# Altium project BTM_MAIN_UNIT.PrjPcb (part 2 of 3)

## Sheet SIM_INTERFACE.SchDoc
size A; SheetNumber: 13; SheetTotal: 28
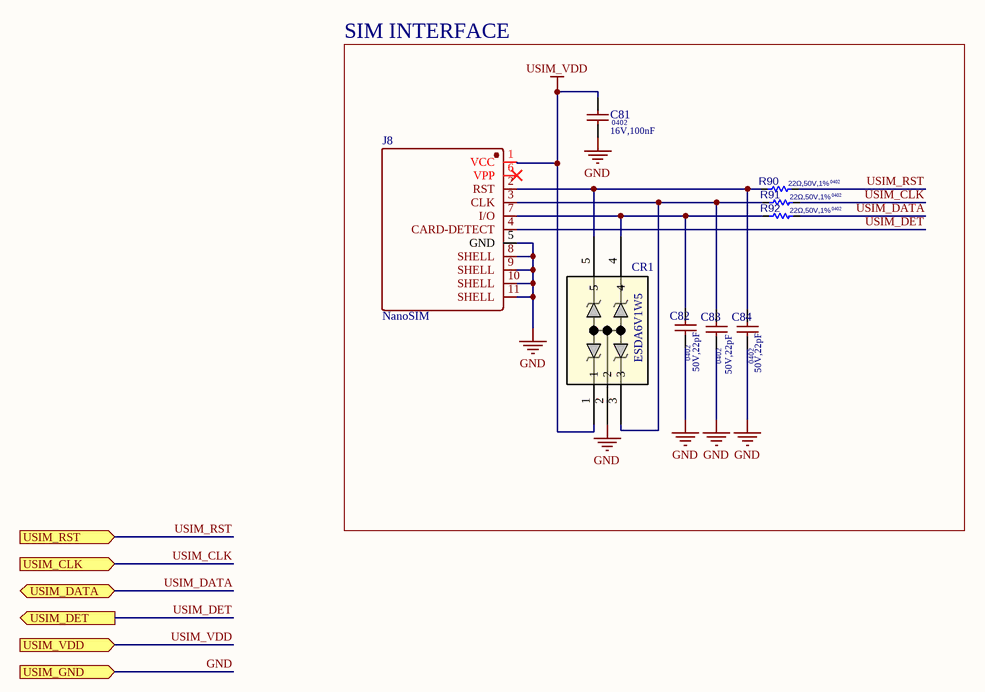
[diagram p11: SIM_INTERFACE.SchDoc]

### Parts
C81  value 16V,100nF  Package: 0402  [C0402]  (hidden comment: 100nf)
C82  value 50V,22pF  Package: 0402  [C0402]  (hidden comment: 22pF)
C83  value 50V,22pF  Package: 0402  [C0402]  (hidden comment: 22pF)
C84  value 50V,22pF  Package: 0402  [C0402]  (hidden comment: 22pF)
CR1  ESDA6V1W5  [SOT323-5L_STM]
J8  NanoSIM  [XKNANO-113]
R90  value 22Ω,50V,1%  Package: 0402  [R0402]  (hidden comment: 100KΩ)
R91  value 22Ω,50V,1%  Package: 0402  [R0402]  (hidden comment: 100KΩ)
R92  value 22Ω,50V,1%  Package: 0402  [R0402]  (hidden comment: 100KΩ)

### Blocks framed on the sheet
SIM INTERFACE: C81-C84 CR1 J8 R90-R92

### Ports
USIM_CLK (in), USIM_DATA (bidir), USIM_DET (out), USIM_GND (in), USIM_RST (in), USIM_VDD (in)

### Nets
GND: C81.1 C82.1 C83.1 C84.1 CR1.2 J8.5(GND) J8.8(SHELL) J8.9(SHELL) J8.10(SHELL) J8.11(SHELL) ; port USIM_GND
USIM_VDD: C81.2 CR1.1 J8.1(VCC) ; port USIM_VDD
USIM_CLK: R91.2 ; port USIM_CLK
USIM_DATA: R92.2 ; port USIM_DATA
USIM_DET: J8.4(CARD-DETECT) ; port USIM_DET
USIM_RST: R90.2 ; port USIM_RST
NetC82_2: C82.2 CR1.4 J8.7(I/O) R92.1
NetC83_2: C83.2 CR1.3 J8.3(CLK) R91.1
NetC84_2: C84.2 CR1.5 J8.2(RST) R90.1

Not connected (* = marked no-connect by the designer): J8 6(VPP)*

### Library data of the parts
C81 = CL05B104KO5NNNC: 16V 100nF X7R ±10% 0402 Multilayer Ceramic Capacitors MLCC - SMD/SMT ROHS; Manufacturer: KEMET; MPN: CC0603KRX7R9BB104; Datasheet: http://componentsearchengine.com/Datasheets/3/CC0603KRX7R9BB104.pdf; LCSC: C1525
C82-C84 = 0402CG220J500NT: 50V 22pF C0G ±5% 0402 Multilayer Ceramic Capacitors MLCC - SMD/SMT ROHS; Manufacturer: KEMET; MPN: CC0603KRX7R9BB104; Datasheet: http://componentsearchengine.com/Datasheets/3/CC0603KRX7R9BB104.pdf; LCSC: C1555
CR1 = ESDA6V1W5: Clamp Ipp Tvs Diode Surface Mount SOT-323-5; Manufacturer: STMicroelectronics; RefDes: RefDes; Type: Type; MPN: ESDA6V1W5; LCSC: C48677; Package: SOT-353-5L
J8 = XKNANO-113: Copper Alloy Self bomb Gold plating 1.25mm Deck -40℃~+85℃ 260℃ NanoSIM SMD SIM Card Connectors ROHS; Datasheet Link: https://datasheet.lcsc.com/lcsc/2110151630_XKB-Connection-XKNANO-113_C381071.pdf; LCSC: C381071; MPN: XKNANO-113
R90-R92 = RC0402FR-0722RL: 62.5mW Thick Film Resistors 50V ±100ppm/℃ ±1% 22Ω 0402 Chip Resistor - Surface Mount ROHS; Manufacturer: YAGEO; Max Operating Temp: +155; Type: *; Datasheet: https://datasheet.lcsc.com/lcsc/2304140030_YAGEO-RC0402FR-0722RL_C114765.pdf; MPN: RC0402FR-0722RL; Min Operating Temp: -55; LCSC: C114765

## Sheet BUZZER.SchDoc
size A; SheetNumber: 13; SheetTotal: 31
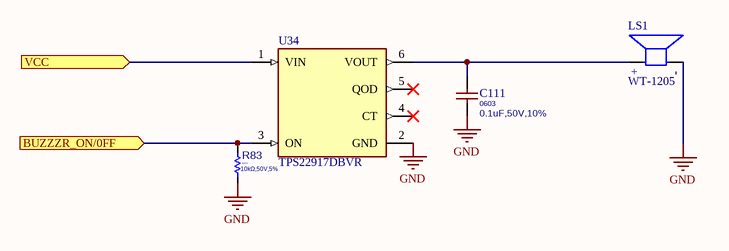
[diagram p12: BUZZER.SchDoc]

### Parts
C111  Package: 0603  [C0603]  (hidden comment: 0.1uF,50V,10%)
LS1  WT-1205  [XDCR_AT-1224-TWT-5V-2-R]
R83  value 10kΩ,50V,5%  Package: 0402  [R0402]  (hidden comment: 10kΩ)
U34  TPS22917DBVR  [SOT95P280X145-6N]

### Ports
BUZZZR_ON/0FF (in), VCC (in)

### Nets
+4.2V: U34.1(VIN) ; port VCC
GND: C111.1 LS1.N R83.1 U34.2(GND)
BUZZER: R83.2 U34.3(ON) ; port BUZZZR_ON/0FF
NetC111_2: C111.2 LS1.P U34.6(VOUT)

Not connected (* = marked no-connect by the designer): U34 4(CT)* 5(QOD)*

### Notes on the sheet
- (in symbol WT-1205) +; -

### Library data of the parts
C111 = GCM188R71H104KA57J: CAP CER 0.1UF 50V X7R 0603; Manufacturer: Murata Electronics; Type: SM; Min Operating Temp: -55°C; Max Operating Temp: 125°C; MPN: GCM188R71H104KA57J; Datasheet: https://datasheet.lcsc.com/lcsc/2404081050_Murata-Electronics-GCM188R71H104KA57J_C3011652.pdf; LCSC: C3011652; Value: 0.1uF,50V,10%
LS1 = WT-1205: Buzzers Transducer, Externally Driven Magnetic 5 V 50mA 2.4kHz 87dB @ 5V, 10cm Through Hole PC Pins; MP: AT-1224-TWT-5V-2-R; Package: None; Price: None; Value: *; Availability: Unavailable
R83 = RC0402JR-0710KL: as R60 on sheet BQ24259RGER; MPN: RC0402JR-0710KL; Max Operating Temp: +155; Min Operating Temp: -55; Datasheet: https://datasheet.lcsc.com/lcsc/1810241334_YAGEO-RC0402JR-0710KL_C60489.pdf; LCSC: C60489
U34 = TPS22917DBVR: 5.5-V, 2-A, 80-mÎ© , 10-nA leakage load switch adj. rise time and adj output discharge; MF: Texas Instruments; SnapEDA_Link: https://www.snapeda.com/parts/TPS22917DBVR/Texas+Instruments/view-part/?ref=snap; Package: SOT-23-6 Texas Instruments; Value: *; MP: TPS22917DBVR; Check_prices: https://www.snapeda.com/parts/TPS22917DBVR/Texas+Instruments/view-part/?ref=eda

## Sheet ESP8266 MODULE.SchDoc
size A; SheetNumber: 15; SheetTotal: 30
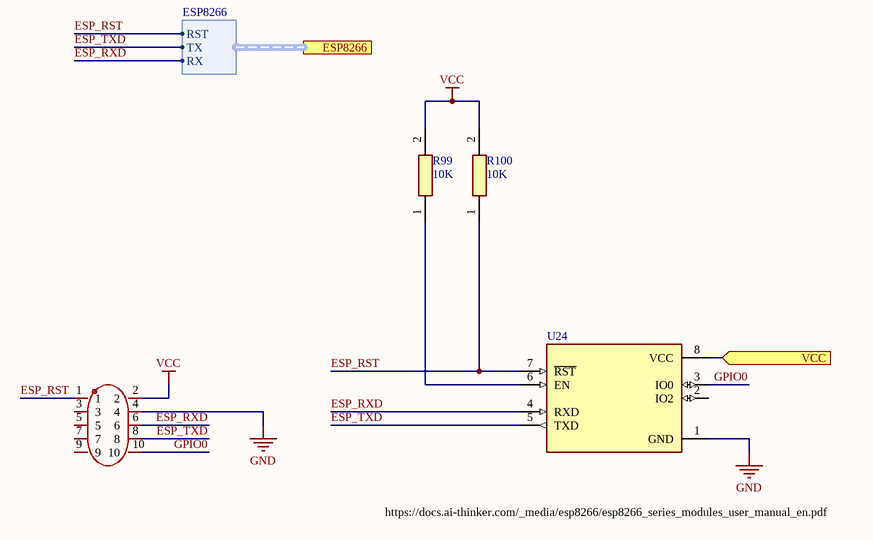
[diagram p13: ESP8266 MODULE.SchDoc]

### Parts
R99  10K  [r-0603]
R100  10K  [r-0603]
U24  (no value)  [XCVR_ESP8266-01/ESP-01]
U31  (no value)  [HDR-TH_10P-P2.54-V-M-R2-C5-S2.54]

### Ports
ESP8266 (harness ESP8266), VCC (in)

### Harnesses
ESP8266: RST, TX, RX

### Nets
GND: U24.1(GND) U31.4
VCC: R99.2 R100.2 U31.2  [project net +3.3V]
ESP8266_VCC: U24.8(VCC) ; port VCC
ESP_RST: R100.1 U24.7(~{RST}) U31.1 ; port ESP8266.RST  [project net ESP32_RST]
ESP_RXD: U24.4(RXD) U31.6 ; port ESP8266.RX
ESP_TXD: U24.5(TXD) U31.8 ; port ESP8266.TX
GPIO0: U24.3(IO0) U31.10
NetR99_1: R99.1 U24.6(EN)

Not connected (* = marked no-connect by the designer): U24 2(IO2); U31 3 5 7 9

### Notes on the sheet
- https://docs.ai-thinker.com/_media/esp8266/esp8266_series_modules_user_manual_en.pdf

### Library data of the parts
R99 R100 = 0603WAF1002T5E: 100mW Thick Film Resistors ±100ppm/℃ ±1% 10kΩ 0603 Chip Resistor - Surface Mount ROHS; Manufacturer_Name: UNI-ROYAL(Uniroyal Elec); Datasheet Link: https://datasheet.lcsc.com/szlcsc/Uniroyal-Elec-0603WAF1002T5E_C25804.pdf; Height: 0.55mm; Manufacturer_Part_Number: 0603WAF1002T5E
U24 = ESP8266-01/ESP-01: MakerFocus 4pcs ESP8266 ESP-01 Serial Wireless WiFi Transceiver Receiver Module 1MB SPI Flash DC3.0-3.6V Internet of Things WiFi Module Board Compatible with Ar duino; Value: *; Package: None; MPN: ESP8266-01/ESP-01
U31 = ZX-PZ2.54-2-5PZZ: Gold 1kV 3A Direct Insert Policy 2.5mm 10P 6mm -40℃~+105℃ 3mm 2.54mm Brass Double Row Black 2.54mm 2x5P Plugin,P=2.54mm Pin Headers ROHS; Manufacturer: Megastar; LCSC: C7501276; MPN: ZX-PZ2.54-2-5PZZ; Package: 插件,P=2.54mm; Datasheet: https://atta.szlcsc.com/upload/public/pdf/source/20231122/7DD2FA5A7FDBC10CDDB6051CB6BC6AD1.pdf; Operating Temperature Range: -40℃~+105℃

## Sheet Humidity.SchDoc
size A; SheetNumber: 16; SheetTotal: 30
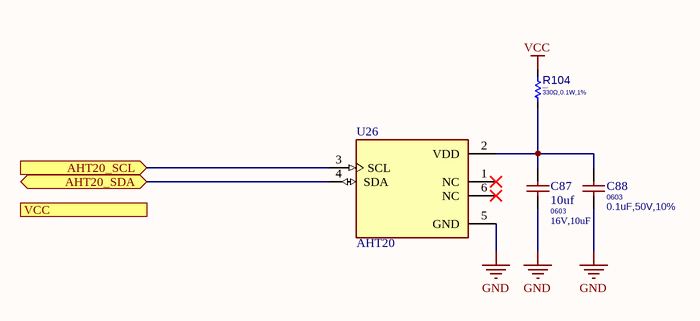
[diagram p14: Humidity.SchDoc]

### Parts
C87  10uf  value 16V,10uF  Package: 0603  [CAPC1608X90N]
C88  Package: 0603  [C0603]  (hidden comment: 0.1uF,50V,10%)
R104  value 330Ω,0.1W,1%  Package: 0603  [R0603]  (hidden comment: 330Ω)
U26  AHT20  [PSON100P300X300X110-6N]

### Ports
AHT20_SCL (in), AHT20_SDA (bidir), VCC (in)

### Nets
GND: C87.1 C88.1 U26.5(GND)
VCC: R104.2 ; port VCC  [project net +3.3V]
I2C1_SCL: U26.3(SCL) ; port AHT20_SCL
I2C1_SDA: U26.4(SDA) ; port AHT20_SDA
NetC87_2: C87.2 C88.2 R104.1 U26.2(VDD)

Not connected (* = marked no-connect by the designer): U26 1(NC)* 6(NC)*

### Library data of the parts
C87 = 0603F106M160NT: as C68 on sheet STM32F446RET6; Datasheet: http://componentsearchengine.com/Datasheets/3/CC0603KRX7R9BB104.pdf; LCSC: C48906
C88 = GCM188R71H104KA57J: as C111 on sheet BUZZER; Min Operating Temp: -55°C; Max Operating Temp: 125°C; MPN: GCM188R71H104KA57J; Datasheet: https://datasheet.lcsc.com/lcsc/2404081050_Murata-Electronics-GCM188R71H104KA57J_C3011652.pdf; LCSC: C3011652; Value: 0.1uF,50V,10%
R104 = RC0603FR-07330RL: 330 Ohms ±1% 0.1W, 1/10W Chip Resistor 0603 (1608 Metric) Moisture Resistant Thick Film; Manufacturer: YAGEO; MPN: RC0603FR-07330RL; Max Operating Temp: +155; Min Operating Temp: -55; Datasheet: https://datasheet.lcsc.com/lcsc/2304140030_YAGEO-RC0603FR-07330RL_C105881.pdf; LCSC: C105881
U26 = AHT20: Temperature and Humidity sensor; MF: Asair; SnapEDA_Link: https://www.snapeda.com/parts/AHT20/Asair/view-part/?ref=snap; MP: AHT20; Check_prices: https://www.snapeda.com/parts/AHT20/Asair/view-part/?ref=eda; Price: None; Value: *; Availability: Not in stock; Package: Package

## Sheet USER_INTERFACE_input.SchDoc
size A; SheetNumber: 18; SheetTotal: 31
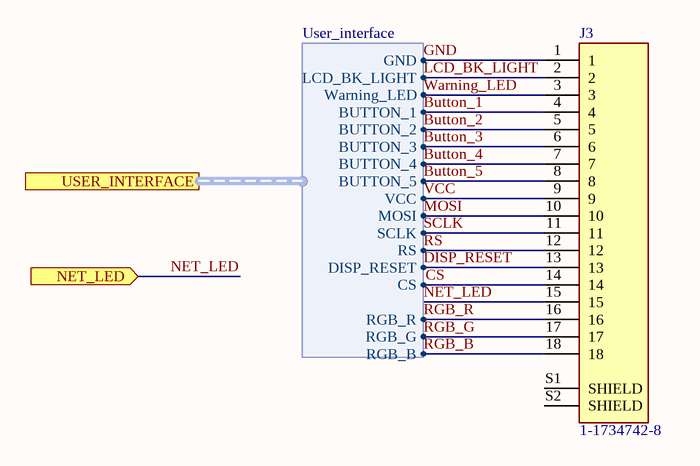
[diagram p15: USER_INTERFACE_input.SchDoc]

### Parts
J3  1-1734742-8  [FPC_SMD_18P_P0.5_vertical]

### Ports
NET_LED (in), USER_INTERFACE (harness User_interface)

### Harnesses
User_interface: GND, BUTTON_1, BUTTON_2, BUTTON_3, BUTTON_4, BUTTON_5, VCC, MOSI, SCLK, RS, DISP_RESET, CS, LCD_BK_LIGHT, Warning_LED, RGB_R, RGB_G, RGB_B

### Nets
GND: J3.1 ; port USER_INTERFACE.GND
VCC: J3.9 ; port USER_INTERFACE.VCC  [project net +3.3V]
BUTTON_1: J3.4 ; port USER_INTERFACE.BUTTON_1
BUTTON_2: J3.5 ; port USER_INTERFACE.BUTTON_2
BUTTON_3: J3.6 ; port USER_INTERFACE.BUTTON_3
BUTTON_4: J3.7 ; port USER_INTERFACE.BUTTON_4
Button_5: J3.8 ; port USER_INTERFACE.BUTTON_5
CS: J3.14 ; port USER_INTERFACE.CS
DISP_RESET: J3.13 ; port USER_INTERFACE.DISP_RESET
LCD_BK_LIGHT: J3.2 ; port USER_INTERFACE.LCD_BK_LIGHT
MOSI: J3.10 ; port USER_INTERFACE.MOSI  [project net LCD_MOSI]
NET_LED: J3.15 ; port NET_LED
RGB_B: J3.18 ; port USER_INTERFACE.RGB_B
RGB_G: J3.17 ; port USER_INTERFACE.RGB_G
RGB_R: J3.16 ; port USER_INTERFACE.RGB_R
RS: J3.12 ; port USER_INTERFACE.RS  [project net LCD_RS]
SCLK: J3.11 ; port USER_INTERFACE.SCLK  [project net LCD_SCLK]
Warning_LED: J3.3 ; port USER_INTERFACE.Warning_LED

Not connected (* = marked no-connect by the designer): J3 S1(SHIELD) S2(SHIELD)

### Library data of the parts
J3 = 1-1734742-8: 18 Position FFC, FPC Connector Contacts, Vertical - 1 Sided 0.020" (0.50mm) Surface Mount; Manufacturer: TE Connectivity; Package: 0.05mm; Datasheet: https://www.te.com/commerce/DocumentDelivery/DDEController?Action=srchrtrv&DocNm=1734742&DocType=Customer+Drawing&DocLang=English; MPN: 1-1734742-8; Operating Temperature: -20°C ~ 85°C; LCSC: C5163208

## Sheet SIM7600G-H_PWR_CTRL.SchDoc
size A; SheetNumber: 20; SheetTotal: 28
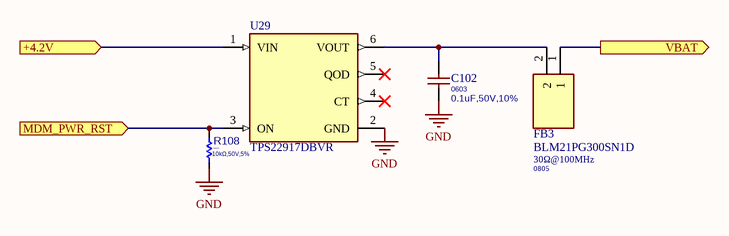
[diagram p16: SIM7600G-H_PWR_CTRL.SchDoc]

### Parts
C102  Package: 0603  [C0603]  (hidden comment: 0.1uF,50V,10%)
FB3  BLM21PG300SN1D  value 30Ω@100MHz  Package: 0805  [BEADC2012X105N]
R108  value 10kΩ,50V,5%  Package: 0402  [R0402]  (hidden comment: 10kΩ)
U29  TPS22917DBVR  [SOT95P280X145-6N]

### Ports
+4.2V (in), MDM_PWR_RST (in), VBAT (out)

### Nets
+4.2V: U29.1(VIN) ; port +4.2V
GND: C102.1 R108.1 U29.2(GND)
VBAT: FB3.1 ; port VBAT
MDM_PWR_RST: R108.2 U29.3(ON) ; port MDM_PWR_RST
NetC102_2: C102.2 FB3.2 U29.6(VOUT)

Not connected (* = marked no-connect by the designer): U29 4(CT)* 5(QOD)*

### Library data of the parts
C102 = GCM188R71H104KA57J: as C111 on sheet BUZZER; Min Operating Temp: -55°C; Max Operating Temp: 125°C; MPN: GCM188R71H104KA57J; Datasheet: https://datasheet.lcsc.com/lcsc/2404081050_Murata-Electronics-GCM188R71H104KA57J_C3011652.pdf; LCSC: C3011652; Value: 0.1uF,50V,10%
FB3 = BLM21PG300SN1D: Ferrite Bead; Manufacturer: Murata Electronics; Datasheet: https://www.murata.com/en-global/products/productdetail?partno=BLM21PG300SN1%23; MPN: BLM21PG300SN1D; LCSC: C16903
R108 = RC0402JR-0710KL: as R60 on sheet BQ24259RGER; MPN: RC0402JR-0710KL; Max Operating Temp: +155; Min Operating Temp: -55; Datasheet: https://datasheet.lcsc.com/lcsc/1810241334_YAGEO-RC0402JR-0710KL_C60489.pdf; LCSC: C60489
U29 = TPS22917DBVR: as U34 on sheet BUZZER; SnapEDA_Link: https://www.snapeda.com/parts/TPS22917DBVR/Texas+Instruments/view-part/?ref=snap; Package: SOT-23-6 Texas Instruments; Value: *; MP: TPS22917DBVR; Check_prices: https://www.snapeda.com/parts/TPS22917DBVR/Texas+Instruments/view-part/?ref=eda

## Sheet BATTERY SOC.SchDoc
size A; SheetNumber: 16; SheetTotal: 28
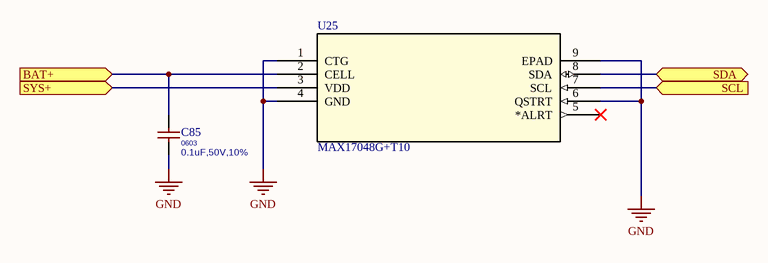
[diagram p17: BATTERY SOC.SchDoc]

### Parts
C85  Package: 0603  [C0603]  (hidden comment: 0.1uF,50V,10%)
U25  MAX17048G+T10  [21-0168E_T822-3_MXM]

### Ports
BAT+ (in), SCL (in), SDA (bidir), SYS+ (in)

### Nets
+3.3V: U25.3(VDD) ; port SYS+
GND: C85.1 U25.1(CTG) U25.4(GND) U25.6(QSTRT) U25.9(EPAD)
BAT+: C85.2 U25.2(CELL) ; port BAT+
I2C1_SCL: U25.7(SCL) ; port SCL
I2C1_SDA: U25.8(SDA) ; port SDA

Not connected (* = marked no-connect by the designer): U25 5(*ALRT)*

### Library data of the parts
C85 = GCM188R71H104KA57J: as C111 on sheet BUZZER; Min Operating Temp: -55°C; Max Operating Temp: 125°C; MPN: GCM188R71H104KA57J; Datasheet: https://datasheet.lcsc.com/lcsc/2404081050_Murata-Electronics-GCM188R71H104KA57J_C3011652.pdf; LCSC: C3011652; Value: 0.1uF,50V,10%
U25 = MAX17048G+T10: No Description Available; Mfr_Name: Analog Devices / Maxim Integrated; RefDes: RefDes; Type: Type

## Sheet ESP8266_PWR_CTRL.SchDoc
size A; SheetNumber: 22; SheetTotal: 30
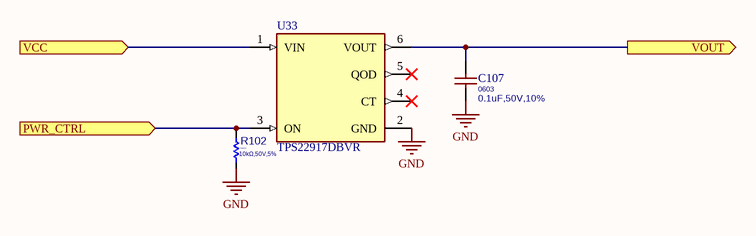
[diagram p18: ESP8266_PWR_CTRL.SchDoc]

### Parts
C107  Package: 0603  [C0603]  (hidden comment: 0.1uF,50V,10%)
R102  value 10kΩ,50V,5%  Package: 0402  [R0402]  (hidden comment: 10kΩ)
U33  TPS22917DBVR  [SOT95P280X145-6N]

### Ports
PWR_CTRL (in), VCC (in), VOUT (out)

### Nets
+3.3V: U33.1(VIN) ; port VCC
GND: C107.1 R102.1 U33.2(GND)
ESP8266_PWR_CTRL: R102.2 U33.3(ON) ; port PWR_CTRL
ESP8266_VCC: C107.2 U33.6(VOUT) ; port VOUT

Not connected (* = marked no-connect by the designer): U33 4(CT)* 5(QOD)*

### Library data of the parts
C107 = GCM188R71H104KA57J: as C111 on sheet BUZZER; Min Operating Temp: -55°C; Max Operating Temp: 125°C; MPN: GCM188R71H104KA57J; Datasheet: https://datasheet.lcsc.com/lcsc/2404081050_Murata-Electronics-GCM188R71H104KA57J_C3011652.pdf; LCSC: C3011652; Value: 0.1uF,50V,10%
R102 = RC0402JR-0710KL: as R60 on sheet BQ24259RGER; MPN: RC0402JR-0710KL; Max Operating Temp: +155; Min Operating Temp: -55; Datasheet: https://datasheet.lcsc.com/lcsc/1810241334_YAGEO-RC0402JR-0710KL_C60489.pdf; LCSC: C60489
U33 = TPS22917DBVR: as U34 on sheet BUZZER; SnapEDA_Link: https://www.snapeda.com/parts/TPS22917DBVR/Texas+Instruments/view-part/?ref=snap; Package: SOT-23-6 Texas Instruments; Value: *; MP: TPS22917DBVR; Check_prices: https://www.snapeda.com/parts/TPS22917DBVR/Texas+Instruments/view-part/?ref=eda

## Sheet BOOST_CONVERTER.SchDoc
size A; SheetNumber: 21; SheetTotal: 31
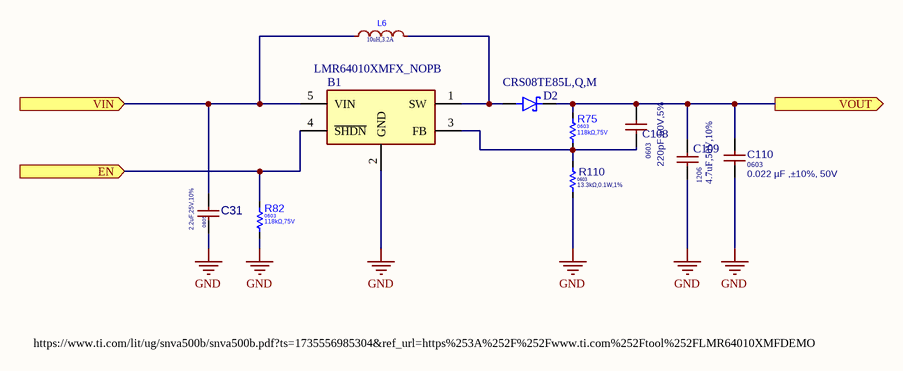
[diagram p19: BOOST_CONVERTER.SchDoc]

### Parts
B1  LMR64010XMFX_NOPB  [SOT95P280X145-5N]
C31  Package: 0805  [C0805]  (hidden comment: 2.2uF,25V,10%)
C108  value 220pF,50V,5%  Package: 0603  [C0603]  (hidden comment: 220pF)
C109  value 4.7uF,50V,10%  Package: 1206  [C1206]  (hidden comment: 4.7uF)
C110  value 0.022 µF ,±10%, 50V  Package: 0603  [C0603]  (hidden comment: 0.022 µF)
D2  CRS08TE85L,Q,M  [S-FLAT_TOS]
L6  value 10uH,3.2A  [inductor_SMD,5.2x5.4mm]  (hidden comment: 10uH)
R75  value 118kΩ,75V  Package: 0603  [R0603]  (hidden comment: 118kΩ)
R82  value 118kΩ,75V  Package: 0603  [R0603]  (hidden comment: 118kΩ)
R110  value 13.3kΩ,0.1W,1%  Package: 0603  [R0603]  (hidden comment: 13.3K)

### Ports
EN (in), VIN (in), VOUT (out)

### Nets
+4.2V: B1.5(VIN) C31.2 L6.1 ; port VIN
+12V: C108.2 C109.2 C110.2 D2.2(K) R75.1 ; port VOUT
GND: B1.2(GND) C31.1 C109.1 C110.1 R82.2 R110.1
BOOST_COV_ON/OFF: B1.4(~{SHDN}) R82.1 ; port EN
NetB1_1: B1.1(SW) D2.1(A) L6.2
NetB1_3: B1.3(FB) C108.1 R75.2 R110.2

### Notes on the sheet
- https://www.ti.com/lit/ug/snva500b/snva500b.pdf?ts=1735556985304&ref_url=https%253A%252F%252Fwww.ti.com%252Ftool%252FLMR64010XMFDEMO

### Library data of the parts
B1 = LMR64010XMFX_NOPB: SIMPLE SWITCHER 2.7V to 14V, 1A Step-Up Regulator in SOT-23 Package; Manufacturer_Name: Texas Instruments; Manufacturer_Part_Number: LMR64010XMFX/NOPB; Geometry.Height: 1.45mm; Mouser Part Number: 926-LMR64010XMFXNOPB; Mouser Price/Stock: https://www.mouser.co.uk/ProductDetail/Texas-Instruments/LMR64010XMFX-NOPB?qs=51W%2FvVdgODjFVfZsQmPpyA%3D%3D; Datasheet Link: http://www.ti.com/lit/gpn/lmr64010
C31 = CAP_Template_0805: CAP CER 2.2UF 25V X7R 10% 0805; Manufacturer: Samsung; MPN: CL21B225KAFNNNE; Type: SM; Max Operating Temp: 105; Min Operating Temp: -55; Datasheet: https://datasheet.lcsc.com/lcsc/2304140030_Samsung-Electro-Mechanics-CL21B225KAFNNNE_C19110.pdf; LCSC: C19110; Value: 2.2uF,25V,10%
C108 = C0603C221J5GACTU: 220 pF ±5% 50V Ceramic Capacitor C0G, NP0 0603 (1608 Metric); Manufacturer: KEMET; Type: *; MPN: C0603C221J5GACTU; Min Operating Temp: -55; Datasheet: https://search.kemet.com/download/datasheet/C0603C221J5GAC7867; Max Operating Temp: +125; LCSC: C452747
C109 = GRM32ER71H475KA88L: 4.7 µF ±10% 50V Ceramic Capacitor X7R 1210 (3225 Metric); Manufacturer: Murata Electronics; Datasheet: https://search.murata.co.jp/Ceramy/image/img/A01X/G101/ENG/GRM32ER71H475KA88-01.pdf; LCSC: C86052; MPN: GRM32ER71H475KA88L
C110 = GRM188R71H223KA01D: 0.022 µF ±10% 50V Ceramic Capacitor X7R 0603 (1608 Metric); Manufacturer: Murata Electronics; Type: *; MPN: GRM188R71H223KA01D; Min Operating Temp: -55; Datasheet: https://search.murata.co.jp/Ceramy/image/img/A01X/G101/ENG/GRM188R71H223KA01-01.pdf; Max Operating Temp: +125; LCSC: C77056
D2 = CRS08TE85L,Q,M: DIODE SCHOTTKY 30V 1.5A S-FLAT; Mfr_Name: Toshiba Electronic Devices & Storage Corp.; MPN: CRS08(TE85L,Q,M); value: 30 V,1.5A
L6 = FXL0530-100-M: 3.2A 10uH Integrated molded inductor ±20% 3.5A SMD,5.2x5.4mm Power Inductors ROHS; Manufacturer: cjiang; LCSC: C177248; MPN: FXL0530-100-M; Package: SMD,5.2x5.4mm; Datasheet: https://atta.szlcsc.com/upload/public/pdf/source/20240426/3189EA8206330E2108542F9E34E540E7.pdf
R75 R82 = 0603WAF1183T5E: 100mW Thick Film Resistors 75V ±100ppm/℃ ±1% 118kΩ 0603 Chip Resistor - Surface Mount ROHS; Manufacturer: UNI-ROYAL; LCSC: C25806; MPN: 0603WAF1183T5E; Datasheet: https://atta.szlcsc.com/upload/public/pdf/source/20200306/C422600_1E6D84923E4A46A82E41ADD87F860B5C.pdf; Operating Temperature Range: -55℃~+155℃
R110 = CRCW060313K3FKEA: 13.3 kOhms ±1% 0.1W, 1/10W Chip Resistor 0603 (1608 Metric) Automotive AEC-Q200 Thick Film; Manufacturer: Vishay Dale; Type: *; Min Operating Temp: -55; MPN: CRCW060313K3FKEA; Datasheet: https://www.vishay.com/docs/20035/dcrcwe3.pdf; Max Operating Temp: +155; LCSC: C844126

## Sheet 5v to 3.3V LDO.SchDoc
size A; SheetNumber: 17; SheetTotal: 31
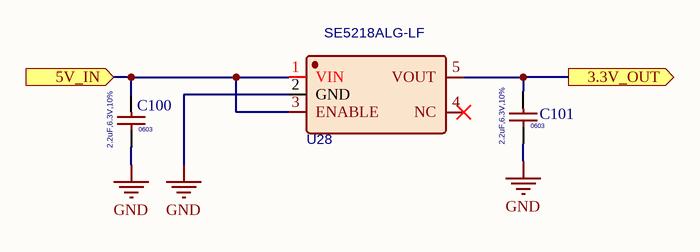
[diagram p20: 5v to 3.3V LDO.SchDoc]

### Parts
C100  Package: 0603  [C0603]  (hidden comment: 2.2uF,6.3V,10%)
C101  Package: 0603  [C0603]  (hidden comment: 2.2uF,6.3V,10%)
U28  SE5218ALG-LF  [SOT-23-5]

### Ports
3.3V_OUT (out), 5V_IN (in)

### Nets
+3.3V_LDO: C101.1 U28.5(VOUT) ; port 3.3V_OUT
GND: C100.2 C101.2 U28.2(GND)
VUSB: C100.1 U28.1(VIN) U28.3(ENABLE) ; port 5V_IN

Not connected (* = marked no-connect by the designer): U28 4(NC)*

### Library data of the parts
C100 C101 = CGA3E1X7R0J225K080AC: CAP CER 2.2UF 6.3V X7R 0603; Manufacturer: TDK Corporation; Type: SM; Min Operating Temp: -55°C; Max Operating Temp: 125°C; MPN: CGA3E1X7R0J225K080AC; Datasheet: https://product.tdk.com/system/files/dam/doc/product/capacitor/ceramic/mlcc/catalog/mlcc_automotive_general_en.pdf; Value: 2.2uF,6.3V,10%
U28 = SE5218ALG-LF: 75dB 500mA Adjustable 3.3V Positive electrode 5V SOT-23-5 Voltage Regulators - Linear, Low Drop Out (LDO) Regulators ROHS; Manufacturer: SEAWARD(思旺); MPN: SE5218ALG-LF; LCSC: C118233; Datasheet: https://www.lcsc.com/datasheet/lcsc_datasheet_2304140030_Seaward-Elec-SE5218ALG-LF_C118233.pdf; Package: SOT-23-5

## Sheet FLASH MEMORY.SchDoc
size A4; SheetNumber: 20; SheetTotal: 26
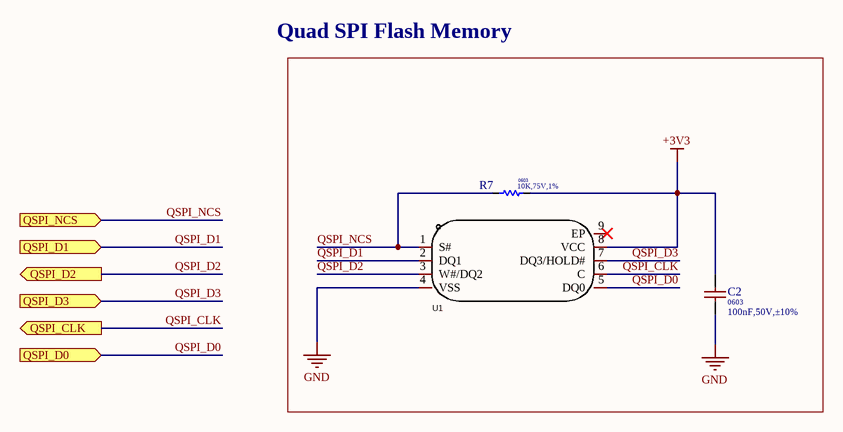
[diagram p21: FLASH MEMORY.SchDoc]

### Parts
C2  value 100nF,50V,±10%  Package: 0603  [C0603]  (hidden comment: CL10B104KB8NNNC)
R7  Package: 0603  [R0603]  (hidden comment: 10K,75V,1%)
U1  MT25QL128ABA1EW9-0SIT  [WSON-8(6x8)]  (value not drawn)

### Ports
QSPI_CLK (out), QSPI_D0 (in), QSPI_D1 (in), QSPI_D2 (out), QSPI_D3 (in), QSPI_NCS (in)

### Nets
+3V3: C2.2 R7.2 U1.8(VCC)
GND: C2.1 U1.4(VSS)
QSPI_CLK: U1.6(C) ; port QSPI_CLK
QSPI_D0: U1.5(DQ0) ; port QSPI_D0
QSPI_D1: U1.2(DQ1) ; port QSPI_D1
QSPI_D2: U1.3(W#/DQ2) ; port QSPI_D2
QSPI_D3: U1.7(DQ3/HOLD#) ; port QSPI_D3
QSPI_NCS: R7.1 U1.1(S#) ; port QSPI_NCS

Not connected (* = marked no-connect by the designer): U1 9(EP)*

### Notes on the sheet
- Quad SPI Flash Memory

### Library data of the parts
C2 = CL10B104KB8NNNC: 50V 100nF X7R ±10% 0603 Multilayer Ceramic Capacitors MLCC - SMD/SMT ROHS; Manufacturer: SAMSUNG; Max Operating Temp: 125; Min Operating Temp: -55; MPN: CL10B104KB8NNNC; Datasheet: https://datasheet.lcsc.com/lcsc/2304140030_Samsung-Electro-Mechanics-CL10B104KB8NNNC_C1591.pdf; LCSC: C1591
R7 = 0603WAF1002T5E: 100mW Thick Film Resistors ±100ppm/℃ ±1% 10kΩ 0603 Chip Resistor - Surface Mount ROHS; Manufacturer: UNI-ROYAL(Uniroyal Elec); Max Operating Temp: 155℃; Min Operating Temp: -55℃; MPN: 0603WAF1002T5E; Datasheet: https://datasheet.lcsc.com/szlcsc/Uniroyal-Elec-0603WAF1002T5E_C25804.pdf; Value: 10K,75V,1%; LCSC: C25804
U1 = MT25QL128ABA1EW9-0SIT: WSON-8(6x8) NOR FLASH ROHS; Manufacturer: micron(镁光); LCSC: C524863; MPN: MT25QL128ABA1EW9-0SIT; Package Reference: WSON-8(6x8); Datasheet: https://atta.szlcsc.com/upload/public/pdf/source/20190912/C427722_3FD902587F3F6B4A9D46B2B844CAD1C1.pdf

## Sheet ETHERNET_W5500.SchDoc
size A4; SheetNumber: 21; SheetTotal: 26
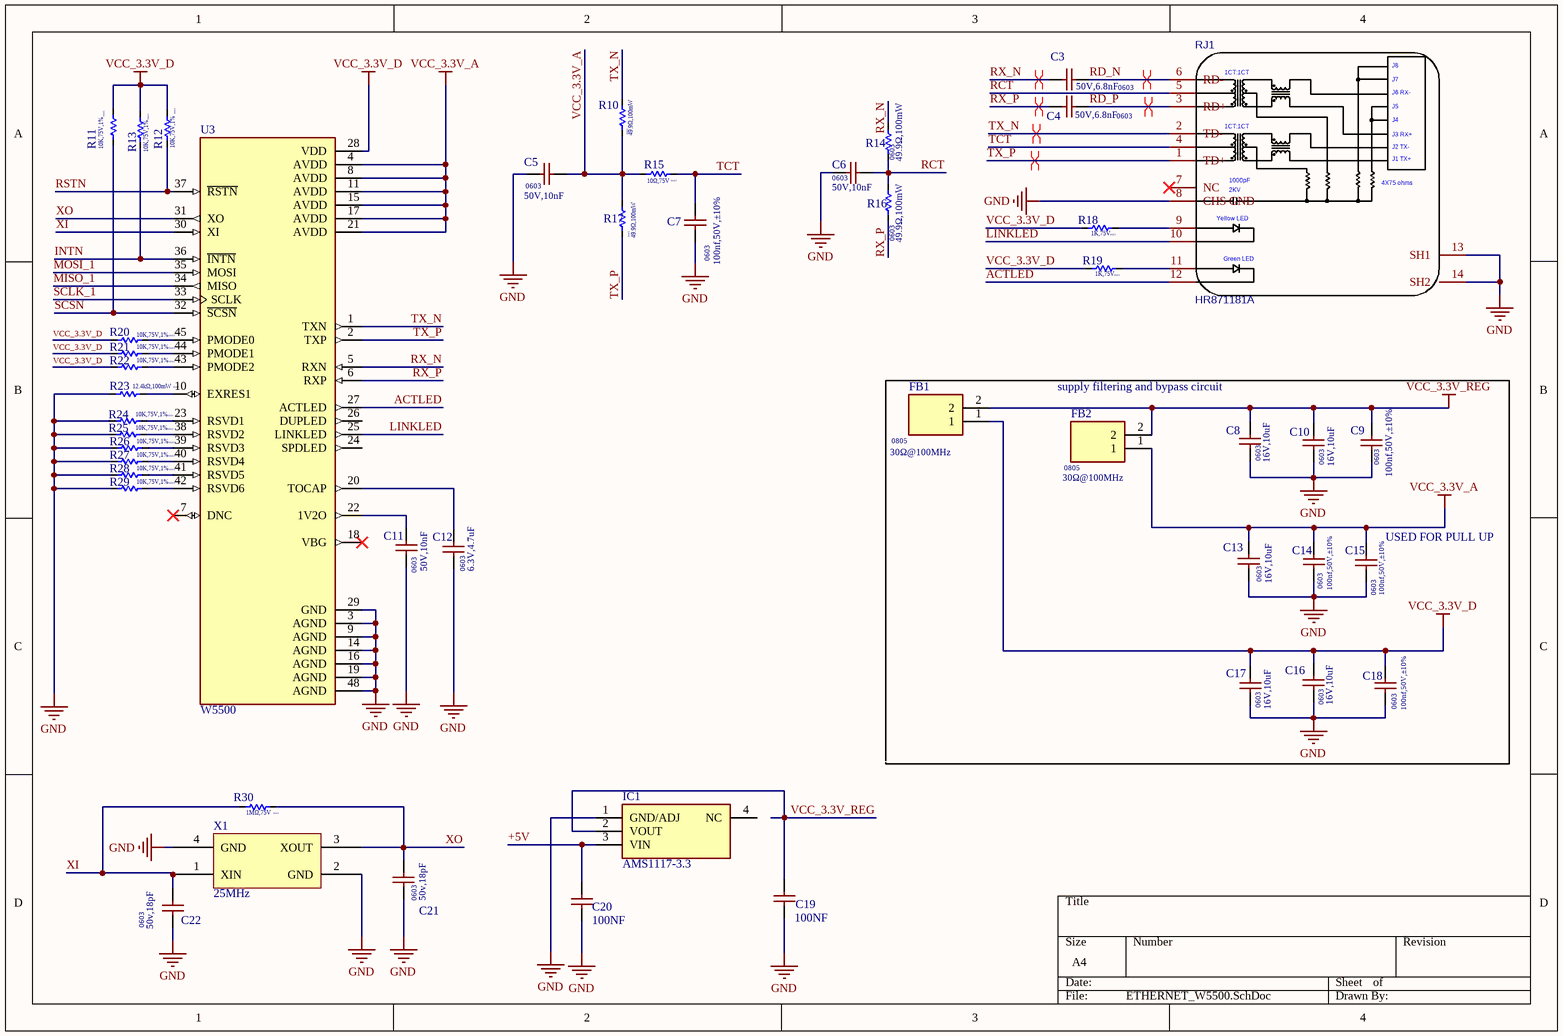
[diagram p22: ETHERNET_W5500.SchDoc]

### Parts
C3  value 50V,6.8nF  Package: 0603  [CAPC1608X90N]  (hidden comment: 6.8nf)
C4  value 50V,6.8nF  Package: 0603  [CAPC1608X90N]  (hidden comment: 6.8nf)
C5  value 50V,10nF  Package: 0603  [CAPC1608X90N]  (hidden comment: 10nf)
C6  value 50V,10nF  Package: 0603  [CAPC1608X90N]  (hidden comment: 10nf)
C7  value 100nf,50V,±10%  Package: 0603  [C0603]  (hidden comment: 100nf/50v)
C8  value 16V,10uF  Package: 0603  [CAPC1608X90N]  (hidden comment: 10uf)
C9  value 100nf,50V,±10%  Package: 0603  [C0603]  (hidden comment: 100nf/50v)
C10  value 16V,10uF  Package: 0603  [CAPC1608X90N]  (hidden comment: 10uf)
C11  value 50V,10nF  Package: 0603  [CAPC1608X90N]  (hidden comment: 10nf)
C12  value 6.3V,4.7uF  Package: 0603  [CAPC1608X90N]  (hidden comment: 4.7uf)
C13  value 16V,10uF  Package: 0603  [CAPC1608X90N]  (hidden comment: 10uf)
C14  value 100nf,50V,±10%  Package: 0603  [C0603]  (hidden comment: 100nf/50v)
C15  value 100nf,50V,±10%  Package: 0603  [C0603]  (hidden comment: 100nf/50v)
C16  value 16V,10uF  Package: 0603  [CAPC1608X90N]  (hidden comment: 10uf)
C17  value 16V,10uF  Package: 0603  [CAPC1608X90N]  (hidden comment: 10uf)
C18  value 100nf,50V,±10%  Package: 0603  [C0603]  (hidden comment: 100nf/50v)
C19  100NF  [C0603]
C20  100NF  [C0603]
C21  value 50v,18pF  Package: 0603  [CAPC1608X90N]  (hidden comment: 18pF)
C22  value 50v,18pF  Package: 0603  [CAPC1608X90N]  (hidden comment: 18pF)
FB1  value 30Ω@100MHz  Package: 0805  [BEADC2012X105N]  (hidden comment: BLM21PG300SN1D)
FB2  value 30Ω@100MHz  Package: 0805  [BEADC2012X105N]  (hidden comment: BLM21PG300SN1D)
IC1  AMS1117-3.3  [SOT229P700X180-4N]
R10  value 49.9Ω,100mW  Package: 0603  [R0603]  (hidden comment: 49.9 R)
R11  Package: 0603  [R0603]  (hidden comment: 10K,75V,1%)
R12  Package: 0603  [R0603]  (hidden comment: 10K,75V,1%)
R13  Package: 0603  [R0603]  (hidden comment: 10K,75V,1%)
R14  value 49.9Ω,100mW  Package: 0603  [R0603]  (hidden comment: 49.9 R)
R15  value 10Ω,75V  Package: 0603  [R0603]  (hidden comment: 10R)
R16  value 49.9Ω,100mW  Package: 0603  [R0603]  (hidden comment: 49.9 R)
R17  value 49.9Ω,100mW  Package: 0603  [R0603]  (hidden comment: 49.9 R)
R18  value 1K,75V  Package: 0603  [R0603]  (hidden comment: 1K)
R19  value 1K,75V  Package: 0603  [R0603]  (hidden comment: 1K)
R20  Package: 0603  [R0603]  (hidden comment: 10K,75V,1%)
R21  Package: 0603  [R0603]  (hidden comment: 10K,75V,1%)
R22  Package: 0603  [R0603]  (hidden comment: 10K,75V,1%)
R23  value 12.4kΩ,100mW  Package: 0603  [R0603]  (hidden comment: 12.4kΩ)
R24  Package: 0603  [R0603]  (hidden comment: 10K,75V,1%)
R25  Package: 0603  [R0603]  (hidden comment: 10K,75V,1%)
R26  Package: 0603  [R0603]  (hidden comment: 10K,75V,1%)
R27  Package: 0603  [R0603]  (hidden comment: 10K,75V,1%)
R28  Package: 0603  [R0603]  (hidden comment: 10K,75V,1%)
R29  Package: 0603  [R0603]  (hidden comment: 10K,75V,1%)
R30  value 1MΩ,75V  Package: 0603  [R0603]  (hidden comment: 1M)
RJ1  HR871181A  [HR871181A_mirror]
U3  W5500  [W5500 Ethernet]
X1  25MHz  [SMD Crystal]

### Nets
GND: C5.1 C6.1 C7.1 C8.1 C9.1 C10.1 C11.2 C12.2 C13.1 C14.1 C15.1 C16.1 C17.1 C18.1 C19.2 C20.2 C21.2 C22.2 IC1.1(GND/ADJ) R23.1 R24.2 R25.2 R26.2 R27.2 R28.2 R29.2 RJ1.8(CHS_GND) RJ1.13(SH1) RJ1.14(SH2) U3.3(AGND) U3.9(AGND) U3.14(AGND) U3.16(AGND) U3.19(AGND) U3.29(GND) U3.48(AGND) X1.2(GND) X1.4(GND)
VCC_3.3V_A: C5.2 C13.2 C14.2 C15.2 FB2.1 R10.1 R15.1 R17.2 U3.4(AVDD) U3.8(AVDD) U3.11(AVDD) U3.15(AVDD) U3.17(AVDD) U3.21(AVDD)
VCC_3.3V_D: C16.2 C17.2 C18.2 FB1.1 R11.2 R12.2 R13.2 R18.1 R19.1 R20.2 R21.2 R22.2 U3.28(VDD)
VCC_3.3V_REG: C8.2 C9.2 C10.2 C19.1 FB1.2 FB2.2 IC1.2(VOUT)
+5V: C20.1 IC1.3(VIN)
ACTLED: RJ1.12 U3.27(ACTLED)
INTN: R13.1 U3.36(~{INTN})
LINKLED: RJ1.10 U3.25(LINKLED)
MISO_1: U3.34(MISO)
MOSI_1: U3.35(MOSI)
RCT: C6.2 R14.1 R16.2 RJ1.5
RD_N: C3.2 RJ1.6(RD-)
RD_P: C4.2 RJ1.3(RD+)
RSTN: R12.1 U3.37(~{RSTN})
RX_N: C3.1 R14.2 U3.5(RXN)
RX_P: C4.1 R16.1 U3.6(RXP)
SCLK_1: U3.33(SCLK)
SCSN: R11.1 U3.32(~{SCSN})
TCT: C7.2 R15.2 RJ1.4
TX_N: R10.2 RJ1.2(TD-) U3.1(TXN)
TX_P: R17.1 RJ1.1(TD+) U3.2(TXP)
XI: C22.1 R30.1 U3.30(XI) X1.1(XIN)
XO: C21.1 R30.2 U3.31(XO) X1.3(XOUT)
NetC11_1: C11.1 U3.22(1V2O)
NetC12_1: C12.1 U3.20(TOCAP)
NetR18_2: R18.2 RJ1.9
NetR19_2: R19.2 RJ1.11
NetR20_1: R20.1 U3.45(PMODE0)
NetR21_1: R21.1 U3.44(PMODE1)
NetR22_1: R22.1 U3.43(PMODE2)
NetR23_2: R23.2 U3.10(EXRES1)
NetR24_1: R24.1 U3.23(RSVD1)
NetR25_1: R25.1 U3.38(RSVD2)
NetR26_1: R26.1 U3.39(RSVD3)
NetR27_1: R27.1 U3.40(RSVD4)
NetR28_1: R28.1 U3.41(RSVD5)
NetR29_1: R29.1 U3.42(RSVD6)

Not connected (* = marked no-connect by the designer): IC1 4(NC); RJ1 7(NC)*; U3 7(DNC)* 18(VBG)* 24(SPDLED) 26(DUPLED)

### Layout directives
differential pair; differential pair class RX1: RD_N, RD_P
differential pair; differential pair class RX: RX_N, RX_P
differential pair; differential pair class TX: TX_N, TX_P

### Notes on the sheet
- supply filtering and bypass circuit
- (near C15) USED FOR PULL UP
- (in symbol HR871181A_mirror) J8; 1CT:1CT; J7; J6 RX-; J5; J4; J3 RX+; J2 TX-; J1 TX+; 1000pF; 4X75 ohms; 2KV; Yellow LED; Green LED

### Library data of the parts
C3 C4 = 0603B682K500CT: 50V 6.8nF X7R ±10% 0603 Multilayer Ceramic Capacitors MLCC - SMD/SMT ROHS; Manufacturer: Walsin Tech Corp; Datasheet: https://datasheet.lcsc.com/lcsc/2304140030_Walsin-Tech-Corp-0603B682K500CT_C123518.pdf; LCSC: C123518; MPN: 0603B682K500CT
C5 C6 C11 = TCC0603X7R103M500CT: 50V 10nF X7R ±20% 0603 Multilayer Ceramic Capacitors MLCC - SMD/SMT ROHS; Manufacturer: CCTC; Datasheet: https://datasheet.lcsc.com/lcsc/2304140030_CCTC-TCC0603X7R103M500CT_C376807.pdf; LCSC: C376807; MPN: TCC0603X7R103M500CT
C7 C9 C14 C15 C18 = CC0603KRX7R9BB104: 50V 100nF X7R ±10% 0603 Multilayer Ceramic Capacitors MLCC - SMD/SMT ROHS; MPN: 603-CC603KRX7R9BB104; Manufacturer: KEMET; Max Operating Temp: 35 °C; Min Operating Temp: 15 °C; Datasheet: http://componentsearchengine.com/Datasheets/3/CC0603KRX7R9BB104.pdf; LCSC: C14663
C8 C10 C13 C16 C17 = 0603F106M160NT: 16V 10uF Y5V ±20% 0603 Multilayer Ceramic Capacitors MLCC - SMD/SMT ROHS; Manufacturer: KEMET; MPN: CC0603KRX7R9BB104; Datasheet: http://componentsearchengine.com/Datasheets/3/CC0603KRX7R9BB104.pdf; LCSC: C48906
C12 = CL10A475KQ8NNNC: Capacitor; Manufacturer: Samsung Electro-Mechanics; Datasheet: https://lcsc.componentsearchengine.com/Datasheets/2/CL10A475KQ8NNNC.pdf; MPN: CL10A475KQ8NNNC; LCSC: C8032
C19 C20 = CC0603KRX7R9BB104: 50V 100nF X7R ±10% 0603 Multilayer Ceramic Capacitors MLCC - SMD/SMT ROHS; MPN: 603-CC603KRX7R9BB104; Manufacturer: KEMET; Value: 100nf,50V,±10%; Package: 0603; Max Operating Temp: 35 °C; Min Operating Temp: 15 °C; Datasheet: http://componentsearchengine.com/Datasheets/3/CC0603KRX7R9BB104.pdf; LCSC: C14663
C21 C22 = CC0603JRNPO9BN180: 50V 18pF NP0 ±5% 0603 Multilayer Ceramic Capacitors MLCC - SMD/SMT ROHS; Manufacturer: YAGEO; LCSC: C107040; Datasheet: https://www.lcsc.com/datasheet/lcsc_datasheet_2304140030_YAGEO-CC0603JRNPO9BN180_C107040.pdf; MPN: CC0603JRNPO9BN180
FB1 FB2 = BLM21PG300SN1D: Ferrite Bead; Manufacturer: Murata Electronics; Datasheet: https://www.murata.com/en-global/products/productdetail?partno=BLM21PG300SN1%23; MPN: BLM21PG300SN1D; LCSC: C16903
IC1 = AMS1117-3.3: Integrated Circuit; Manufacturer: Advanced; Datasheet: https://datasheet.datasheetarchive.com/originals/distributors/Datasheets-28/DSA-550594.pdf; MPN: AMS1117-3.3
R10 R14 R16 R17 = ERJ-3EKF49R9V: 100mW Thick Film Resistors ±100ppm/℃ ±1% 49.9Ω 0603 Chip Resistor - Surface Mount ROHS; Manufacturer: Panasonic; Datasheet: https://industrial.panasonic.com/cdbs/www-data/pdf/RDA0000/AOA0000C304.pdf; MPN: ERJ-3EKF49R9V; LCSC: C403255
R11-R13 R20-R22 R24-R29 = 0603WAF1002T5E: as R7 on sheet FLASH MEMORY; Max Operating Temp: 155℃; Min Operating Temp: -55℃; MPN: 0603WAF1002T5E; Datasheet: https://datasheet.lcsc.com/szlcsc/Uniroyal-Elec-0603WAF1002T5E_C25804.pdf; LCSC: C25804; Value: 10K,75V,1%
R15 = QR0603J10R0P05Z: 100mW Thick Film Resistors 75V ±5% ±100ppm/℃ -55℃~+155℃ 10Ω 0603 Chip Resistor - Surface Mount ROHS; Manufacturer: Ever Ohms Tech; Datasheet: https://datasheet.lcsc.com/lcsc/2304140030_Ever-Ohms-Tech-QR0603J10R0P05Z_C176153.pdf; LCSC: C176153; MPN: QR0603J10R0P05Z
R18 R19 = 0603WAF1001T5E: 100mW Thick Film Resistors 75V ±100ppm/℃ ±1% 1kΩ 0603 Chip Resistor - Surface Mount ROHS; Manufacturer: UNI-ROYAL(Uniroyal Elec); Datasheet: https://datasheet.lcsc.com/szlcsc/Uniroyal-Elec-0603WAF1001T5E_C21190.pdf; MPN: 0603WAF1001T5E; LCSC: C21190
R23 = ERJ-3EKF1242V: Resistor; Manufacturer: Panasonic; Datasheet: https://industrial.panasonic.com/cdbs/www-data/pdf/RDA0000/AOA0000C304.pdf; MPN: ERJ-3EKF1242V; LCSC: C194071
R30 = 0603WAF1004T5E: 100mW Thick Film Resistors ±100ppm/℃ ±1% 1MΩ 0603 Chip Resistor - Surface Mount ROHS; Manufacturer: UNI-ROYAL(Uniroyal Elec); MPN: 0603WAF1002T5E; Datasheet: https://datasheet.lcsc.com/szlcsc/Uniroyal-Elec-0603WAF1002T5E_C25804.pdf; LCSC: C22935
RJ1 = HR871181A_mirror: BOM_Manufacturer: HANRUN(汉仁); BOM_Supplier: LCSC; BOM_Manufacturer Part: HR871181A; BOM_Supplier Part: C49312; BOM_JLCPCB Part Class: Extended Part; spicePre: R; spiceSymbolName: HR871181A
U3 = W5500: Ethernet Controller 10/100 Base-T/TX PHY SPI Interface 48-LQFP (7x7); MF: WIZnet; Value: *; Package: None; Check_prices: https://www.snapeda.com/parts/W5500/WIZnet/view-part/?ref=eda; Price: None; MP: W5500; Availability: In Stock; SnapEDA_Link: https://www.snapeda.com/parts/W5500/WIZnet/view-part/?ref=snap; Purchase-URL: https://pricing.snapeda.com/search/part/W5500/?ref=eda
X1 = 3TJ425000XYFBC: 25MHz SMD Crystal Resonator 18pF 60Ω ±10ppm ±30ppm -40℃~+85℃ SMD3225-4P Crystals ROHS

## Sheet ETHERNET_STM32.SchDoc
size A4; SheetNumber: 22; SheetTotal: 26
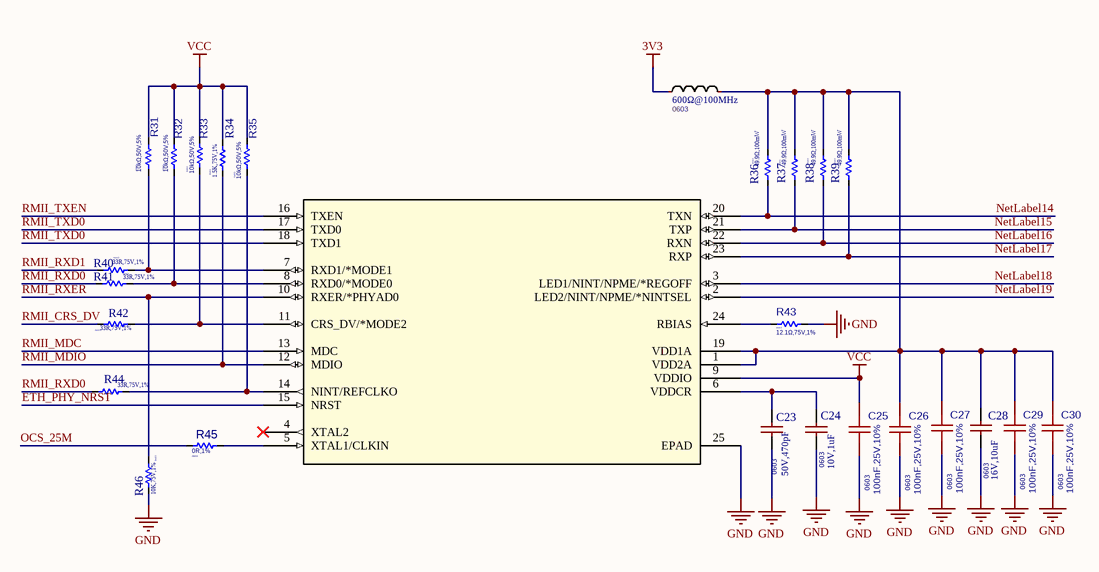
[diagram p23: ETHERNET_STM32.SchDoc]

### Parts
C23  value 50V,470pF  Package: 0603  [c-0603]  (hidden comment: 470pF)
C24  value 10V,1uF  Package: 0603  [CAPC1608X90N]  (hidden comment: 1uF)
C25  value 100nF,25V,10%  Package: 0603  [C0603]  (hidden comment: 100nF)
C26  value 100nF,25V,10%  Package: 0603  [C0603]  (hidden comment: 100nF)
C27  value 100nF,25V,10%  Package: 0603  [C0603]  (hidden comment: 100nF)
C28  value 16V,10uF  Package: 0603  [CAPC1608X90N]  (hidden comment: 10uf)
C29  value 100nF,25V,10%  Package: 0603  [C0603]  (hidden comment: 100nF)
C30  value 100nF,25V,10%  Package: 0603  [C0603]  (hidden comment: 100nF)
R31  value 10kΩ,50V,5%  Package: 0402  [R0402]  (hidden comment: 10kΩ)
R32  value 10kΩ,50V,5%  Package: 0402  [R0402]  (hidden comment: 10kΩ)
R33  value 10kΩ,50V,5%  Package: 0402  [R0402]  (hidden comment: 10kΩ)
R34  value 1.5K,75V,1%  Package: 0603  [R0603]  (hidden comment: 1.5K)
R35  value 10kΩ,50V,5%  Package: 0402  [R0402]  (hidden comment: 10kΩ)
R36  value 49.9Ω,100mW  Package: 0603  [R0603]  (hidden comment: 49.9 R)
R37  value 49.9Ω,100mW  Package: 0603  [R0603]  (hidden comment: 49.9 R)
R38  value 49.9Ω,100mW  Package: 0603  [R0603]  (hidden comment: 49.9 R)
R39  value 49.9Ω,100mW  Package: 0603  [R0603]  (hidden comment: 49.9 R)
R40  value 33R,75V,1%  Package: 0603  [R0603]  (hidden comment: 33R)
R41  value 33R,75V,1%  Package: 0603  [R0603]  (hidden comment: 33R)
R42  value 33R,75V,1%  Package: 0603  [R0603]  (hidden comment: 33R)
R43  value 12.1Ω,75V,1%  Package: 0603  [R0603]  (hidden comment: 12.1K)
R44  value 33R,75V,1%  Package: 0603  [R0603]  (hidden comment: 33R)
R45  Package: 0603  [R0603]  (hidden comment: 0R,1%)
R46  Package: 0603  [R0603]  (hidden comment: 10K,75V,1%)
U4  value 600Ω@100MHz  Package: 0603  [L-0603]  (hidden comment: BLM18AG601SN1D)
U5  LAN8742A-CZ-TR  [QFN-24-EP(4x4)]  (value not drawn)

### Nets
3V3: U4.1
GND: C23.1 C24.1 C25.1 C26.1 C27.1 C28.1 C29.1 C30.1 R43.2 R46.1 U5.25(EPAD)
VCC: C25.2 R31.2 R32.2 R33.2 R34.2 R35.2 U5.9(VDDIO)  [project net +3.3V]
ETH_PHY_NRST: U5.15(NRST)
NetLabel14: R36.1 U5.20(TXN)
NetLabel15: R37.1 U5.21(TXP)
NetLabel16: R38.1 U5.22(RXN)
NetLabel17: R39.1 U5.23(RXP)
NetLabel18: U5.3(LED1/NINT/NPME/*REGOFF)
NetLabel19: U5.2(LED2/NINT/NPME/*NINTSEL)
OCS_25M: R45.1
RMII_CRS_DV: R42.1
RMII_MDC: U5.13(MDC)
RMII_MDIO: R34.1 U5.12(MDIO)
RMII_RXD0: R41.1 R44.1
RMII_RXD1: R40.1
RMII_RXER: R46.2 U5.10(RXER/*PHYAD0)
RMII_TXD0: U5.17(TXD0) U5.18(TXD1)
RMII_TXEN: U5.16(TXEN)
NetC23_2: C23.2 C24.2 U5.6(VDDCR)
NetC26_2: C26.2 C27.2 C28.2 C29.2 C30.2 R36.2 R37.2 R38.2 R39.2 U4.2 U5.1(VDD2A) U5.19(VDD1A)
NetR31_1: R31.1 R40.2 U5.7(RXD1/*MODE1)
NetR32_1: R32.1 R41.2 U5.8(RXD0/*MODE0)
NetR33_1: R33.1 R42.2 U5.11(CRS_DV/*MODE2)
NetR35_1: R35.1 R44.2 U5.14(NINT/REFCLKO)
NetR43_1: R43.1 U5.24(RBIAS)
NetR45_2: R45.2 U5.5(XTAL1/CLKIN)

Not connected (* = marked no-connect by the designer): U5 4(XTAL2)*

### Library data of the parts
C23 = CL10B471KB8NNNC: 50V 470pF X7R ±10% 0603 Multilayer Ceramic Capacitors MLCC - SMD/SMT ROHS; Manufacturer: FH; Datasheet: https://datasheet.lcsc.com/lcsc/2304140030_Samsung-Electro-Mechanics-CL10B471KB8NNNC_C22396.pdf; LCSC: C22396; MPN: CL10B471KB8NNNC
C24 = CL10A105KP8NNNC: 10V 1uF X5R ±10% 0603 Multilayer Ceramic Capacitors MLCC - SMD/SMT ROHS; Manufacturer: SAMSUNG; Datasheet: https://datasheet.lcsc.com/lcsc/2304140030_Samsung-Electro-Mechanics-CL10A105KP8NNNC_C26413.pdf; LCSC: C26413; MPN: CL10A105KP8NNNC
C25-C27 C29 C30 = CL10B104KA8NNNC: 25V 100nF X7R ±10% 0603 Multilayer Ceramic Capacitors MLCC - SMD/SMT ROHS; Manufacturer: SAMSUNG; Type: *; Min Operating Temp: -55; Max Operating Temp: +125; MPN: CL10B104KA8NNNC; Datasheet: https://datasheet.lcsc.com/lcsc/2304140030_Samsung-Electro-Mechanics-CL10B104KA8NNNC_C1590.pdf; LCSC: C1590
C28 = 0603F106M160NT: as C8 on sheet ETHERNET_W5500; Datasheet: http://componentsearchengine.com/Datasheets/3/CC0603KRX7R9BB104.pdf; LCSC: C48906
R31-R33 R35 = RC0402JR-0710KL: 62.5mW Thick Film Resistors 50V ±100ppm/℃ ±5% 10kΩ 0402 Chip Resistor - Surface Mount ROHS; Manufacturer: YAGEO; MPN: RC0402JR-0710KL; Max Operating Temp: +155; Min Operating Temp: -55; Datasheet: https://datasheet.lcsc.com/lcsc/1810241334_YAGEO-RC0402JR-0710KL_C60489.pdf; LCSC: C60489
R34 = RC0603FR-071K5L: 100mW Thick Film Resistors 75V ±100ppm/℃ ±1% 1.5kΩ 0603 Chip Resistor - Surface Mount ROHS; Manufacturer: Yageo; MPN: RC0603FR-071K5L; Datasheet: https://www.lcsc.com/datasheet/lcsc_datasheet_2304140030_YAGEO-RC0603FR-071K5L_C114668.pdf; LCSC: C114668
R36-R39 = ERJ-3EKF49R9V: as R10 on sheet ETHERNET_W5500; Datasheet: https://industrial.panasonic.com/cdbs/www-data/pdf/RDA0000/AOA0000C304.pdf; MPN: ERJ-3EKF49R9V; LCSC: C403255
R40-R42 R44 = RC0603FR-0733RL: 100mW Thick Film Resistors 75V ±100ppm/℃ ±1% 270Ω 0603 Chip Resistor - Surface Mount ROHS; Manufacturer: Yageo; MPN: RC0603FR-0733RL; Datasheet: https://datasheet.lcsc.com/lcsc/2304140030_YAGEO-RC0603FR-0733RL_C108661.pdf; LCSC: C108661
R43 = RC0603FR-0712K1L: 100mW Thick Film Resistors 75V ±100ppm/℃ ±1% 12.1kΩ 0603 Chip Resistor - Surface Mount ROHS; Manufacturer: YAGEO; Type: *; Min Operating Temp: -55; MPN: RC0603FR-0712K1L; Datasheet: https://www.yageo.com/upload/media/product/products/datasheet/rchip/PYu-RC_Group_51_RoHS_L_12.pdf; Max Operating Temp: +155; LCSC: C123417
R45 = AC0603FR-070RL: RES SMD 0 OHM JUMPER 1/10W 0603; Manufacturer: YAGEO; Type: SM; Min Operating Temp: -55°C; Max Operating Temp: 155°C; Datasheet: https://www.yageo.com/upload/media/product/productsearch/datasheet/rchip/PYu-AC_51_RoHS_L_10.pdf; MPN: AC0603FR-070RL; LCSC: C116699; Value: 0R,1%
R46 = 0603WAF1002T5E: as R7 on sheet FLASH MEMORY; Max Operating Temp: 155℃; Min Operating Temp: -55℃; MPN: 0603WAF1002T5E; Datasheet: https://datasheet.lcsc.com/szlcsc/Uniroyal-Elec-0603WAF1002T5E_C25804.pdf; LCSC: C25804; Value: 10K,75V,1%
U4 = BLM18AG601SN1D: 380mΩ ±25% 600Ω@100MHz 0603 Ferrite Beads ROHS; Manufacturer: muRata; LCSC: C19330; MPN: BLM18AG601SN1D; Datasheet: https://www.lcsc.com/datasheet/lcsc_datasheet_2304140030_Murata-Electronics-BLM18AG601SN1D_C19330.pdf
U5 = LAN8742A-CZ-TR: QFN-24-EP(4x4) Ethernet ICs ROHS; Manufacturer: MICROCHIP(美国微芯); Value: Ethernet Transceivers; LCSC: C621424; MPN: LAN8742A-CZ-TR; Package Reference: QFN-24-EP(4x4); Datasheet: https://atta.szlcsc.com/upload/public/pdf/source/20201120/C621424_261C8C55AFDB52EE903AE3A1A642D6DC.pdf; Min Operating Temp: -40; Max Operating Temp: +85

## Sheet RS485.SchDoc
size A; SheetNumber: 24; SheetTotal: 28
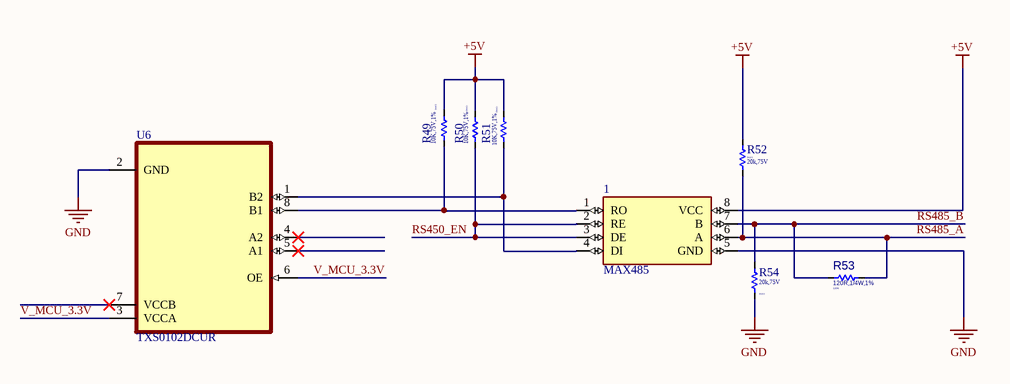
[diagram p24: RS485.SchDoc]

### Parts
1  MAX485  [MAX485]
R49  Package: 0603  [R0603]  (hidden comment: 10K,75V,1%)
R50  Package: 0603  [R0603]  (hidden comment: 10K,75V,1%)
R51  Package: 0603  [R0603]  (hidden comment: 10K,75V,1%)
R52  value 20k,75V  Package: 0603  [R0603]  (hidden comment: 20k)
R53  Package: 1206  [R1206]  (hidden comment: 120R,1/4W,1%)
R54  value 20k,75V  Package: 0603  [R0603]  (hidden comment: 20k)
U6  TXS0102DCUR  [8-VSSOP]

### Nets
+5V: 1.8(VCC) R49.2 R50.2 R51.2 R52.1  [project net VBUS2]
GND: 1.5(GND) R54.1 U6.2(GND)
RS450_EN: 1.2(RE) 1.3(DE) R50.1
RS485_A: 1.6(A) R52.2 R53.2
RS485_B: 1.7(B) R53.1 R54.2
V_MCU_3.3V: U6.3(VCCA) U6.6(OE)
Net1_1: 1.1(RO) R49.1 U6.8(B1)
Net1_4: 1.4(DI) R51.1 U6.1(B2)

Not connected (* = marked no-connect by the designer): U6 4(A2)* 5(A1)* 7(VCCB)*

### Library data of the parts
1 = MAX485: 1/1 Transceiver Half RS422, RS485 8-SOIC; Manufacturer: Maxim Integrated; Package Reference: SOIC-8 Maxim Integrated; Value: *; MPN: MAX485
R49-R51 = 0603WAF1002T5E: as R7 on sheet FLASH MEMORY; Max Operating Temp: 155℃; Min Operating Temp: -55℃; MPN: 0603WAF1002T5E; Datasheet: https://datasheet.lcsc.com/szlcsc/Uniroyal-Elec-0603WAF1002T5E_C25804.pdf; LCSC: C25804; Value: 10K,75V,1%
R52 R54 = 0603WAF2002T5E: 100mW Thick Film Resistors ±100ppm/℃ ±1% 20kΩ 0603 Chip Resistor - Surface Mount ROHS; Manufacturer: UNI-ROYAL(Uniroyal Elec); MPN: 0603WAF1002T5E; Datasheet: https://datasheet.lcsc.com/szlcsc/Uniroyal-Elec-0603WAF1002T5E_C25804.pdf; LCSC: C4184
R53 = RES_Template_1206: RES SMD 120 OHM 1% 1/4W 1206; Manufacturer: YAGEO; MPN: AC1206FR-07120RL; Type: SM; Min Operating Temp: -55°C; Max Operating Temp: 155°C; Datasheet: https://www.yageo.com/upload/media/product/productsearch/datasheet/rchip/PYu-RC_Group_51_RoHS_L_12.pdf; LCSC: C229293; Value: 120R,1/4W,1%
U6 = TXS0102DCUR: 2-Bit Bidirectional Voltage-Level Shifter for Open-Drain and Push-Pull Application 8-VSSOP -40 to 85; Manufacturer: Texas Instruments; Value: 2 Channel 24Mbps; Package: VSSOP-8 Texas Instruments; MPN: TXS0102DCUR; Datasheet: https://www.ti.com/general/docs/suppproductinfo.tsp?distId=10&gotoUrl=https%3A%2F%2Fwww.ti.com%2Flit%2Fgpn%2Ftxs0102; LCSC: C53434

## Sheet OUTPUT.SchDoc
size A; SheetNumber: 9; SheetTotal: 30
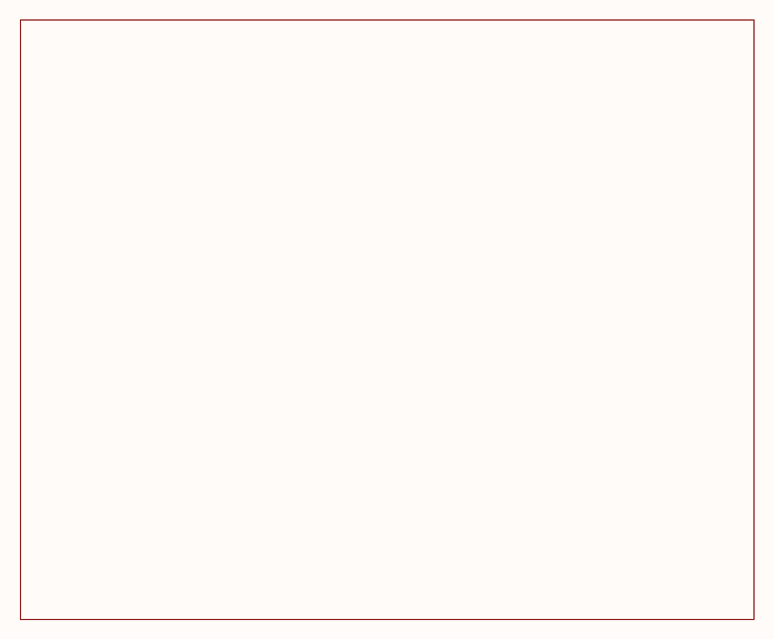
[diagram p25: OUTPUT.SchDoc]

## Sheet SIM7600G-H_USB.SchDoc
size A; SheetNumber: 25; SheetTotal: 28
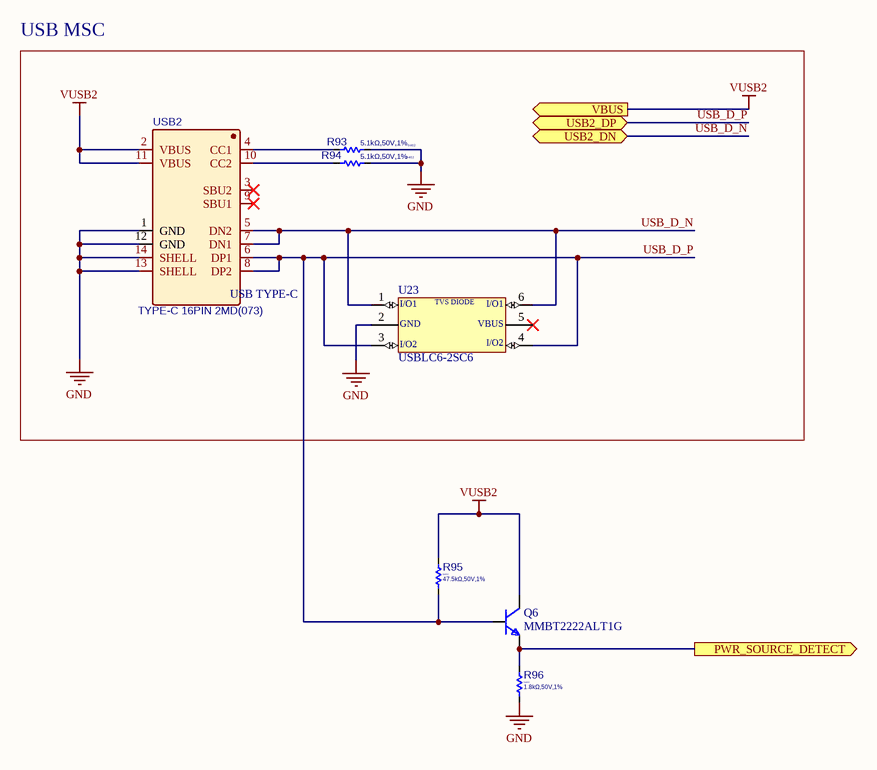
[diagram p26: SIM7600G-H_USB.SchDoc]

### Parts
Q6  MMBT2222ALT1G  [SOT-23]
R93  value 5.1kΩ,50V,1%  Package: 0402  [R0402]  (hidden comment: 5.1KΩ)
R94  value 5.1kΩ,50V,1%  Package: 0402  [R0402]  (hidden comment: 5.1KΩ)
R95  value 47.5kΩ,50V,1%  Package: 0402  [R0402]  (hidden comment: 47.5kΩ)
R96  value 1.8kΩ,50V,1%  Package: 0402  [R0402]  (hidden comment: 1.8kΩ)
U23  USBLC6-2SC6  [SOT95P280X145-6N]
USB2  TYPE-C 16PIN 2MD(073)  [TYPE-C 16PIN 2MD(073)]

### Blocks framed on the sheet
USB MSC: R93 R94 U23 USB2

### Ports
PWR_SOURCE_DETECT (out), USB2_DN (bidir), USB2_DP (bidir), VBUS (out)

### Nets
GND: R93.2 R94.2 R96.1 U23.2(GND) USB2.1(GND) USB2.12(GND) USB2.13(SHELL) USB2.14(SHELL)
VUSB2: Q6.3 R95.2 USB2.2(VBUS) USB2.11(VBUS) ; port VBUS
USB_D_N: U23.1(I/O1_IN) U23.6(I/O1_OUT) USB2.5(DN2) USB2.7(DN1) ; port USB2_DN
USB_D_P: Q6.1 R95.1 U23.3(I/O2_IN) U23.4(I/O2_OUT) USB2.6(DP1) USB2.8(DP2) ; port USB2_DP
NetQ6_2: Q6.2 R96.2 ; port PWR_SOURCE_DETECT
NetR93_1: R93.1 USB2.4(CC1)
NetR94_1: R94.1 USB2.10(CC2)

Not connected (* = marked no-connect by the designer): U23 5(VBUS)*; USB2 3(SBU2)* 9(SBU1)*

### Notes on the sheet
- (in symbol TYPE-C 16PIN 2MD(073)) USB TYPE-C
- (in symbol USBLC6-2SC6) TVS DIODE; I/O1; I/O2

### Library data of the parts
Q6 = MMBT2222ALT1G: Bipolar (BJT) Transistor NPN 40 V 600 mA 300MHz 225 mW Surface Mount SOT-23-3 (TO-236); Manufacturer: ON Semiconductor; Max Operating Temp: +150°C; Min Operating Temp: -55°C; MPN: MMBT2222ALT1G; Package: SOT-23
R93 R94 = RC0402FR-075K1L: 100mW Thick Film Resistors 75V ±100ppm/℃ ±1% 100kΩ 0603 Chip Resistor - Surface Mount ROHS; Manufacturer: YAGEO; Max Operating Temp: +155; MPN: RC0402FR-075K1L; Type: *; Datasheet: https://datasheet.lcsc.com/lcsc/2304140030_YAGEO-RC0402FR-075K1L_C105872.pdf; Min Operating Temp: -55; LCSC: C105872
R95 = AC0402FR-0747K5L: 62.5mW Thick Film Resistors 50V ±100ppm/℃ ±1% 47.5kΩ 0402 Chip Resistor - Surface Mount ROHS; Manufacturer: YAGEO(国巨); Type: *; MPN: AC0402FR-0747K5L; Max Operating Temp: +155; Min Operating Temp: -55; Datasheet: https://datasheet.lcsc.com/lcsc/2304140030_YAGEO-AC0402FR-0747K5L_C227098.pdf; LCSC: C227098
R96 = 0402WGF1801TCE: 62.5mW Thick Film Resistors 50V ±100ppm/℃ ±1% 1.8kΩ 0402 Chip Resistor - Surface Mount ROHS; Manufacturer: YAGEO; MPN: 0402WGF1801TCE; Max Operating Temp: +155; Min Operating Temp: -55; Datasheet: https://www.lcsc.com/datasheet/lcsc_datasheet_2206010045_UNI-ROYAL-Uniroyal-Elec-0402WGF1801TCE_C25871.pdf; LCSC: C25871
U23 = USBLC6-2SC6: 17V Clamp 5A (8/20Âµs) Ipp Tvs Diode Surface Mount SOT-23-6; MF: STMicroelectronics; Value: *; Package: SOT-23-6 STMicroelectronics; MP: USBLC6-2SC6
USB2 = TYPE-C 16PIN 2MD(073): 5A 1 Surface Mount 16P Female -25℃~+85℃ Type-C SMD USB Connectors ROHS; Manufacturer: SHOU HAN(首韩); LCSC: C2765186; Package Reference: TYPE-C 16PIN 2MD(073)

## Sheet NRF52.SchDoc
size A4; SheetNumber: 26; SheetTotal: 28
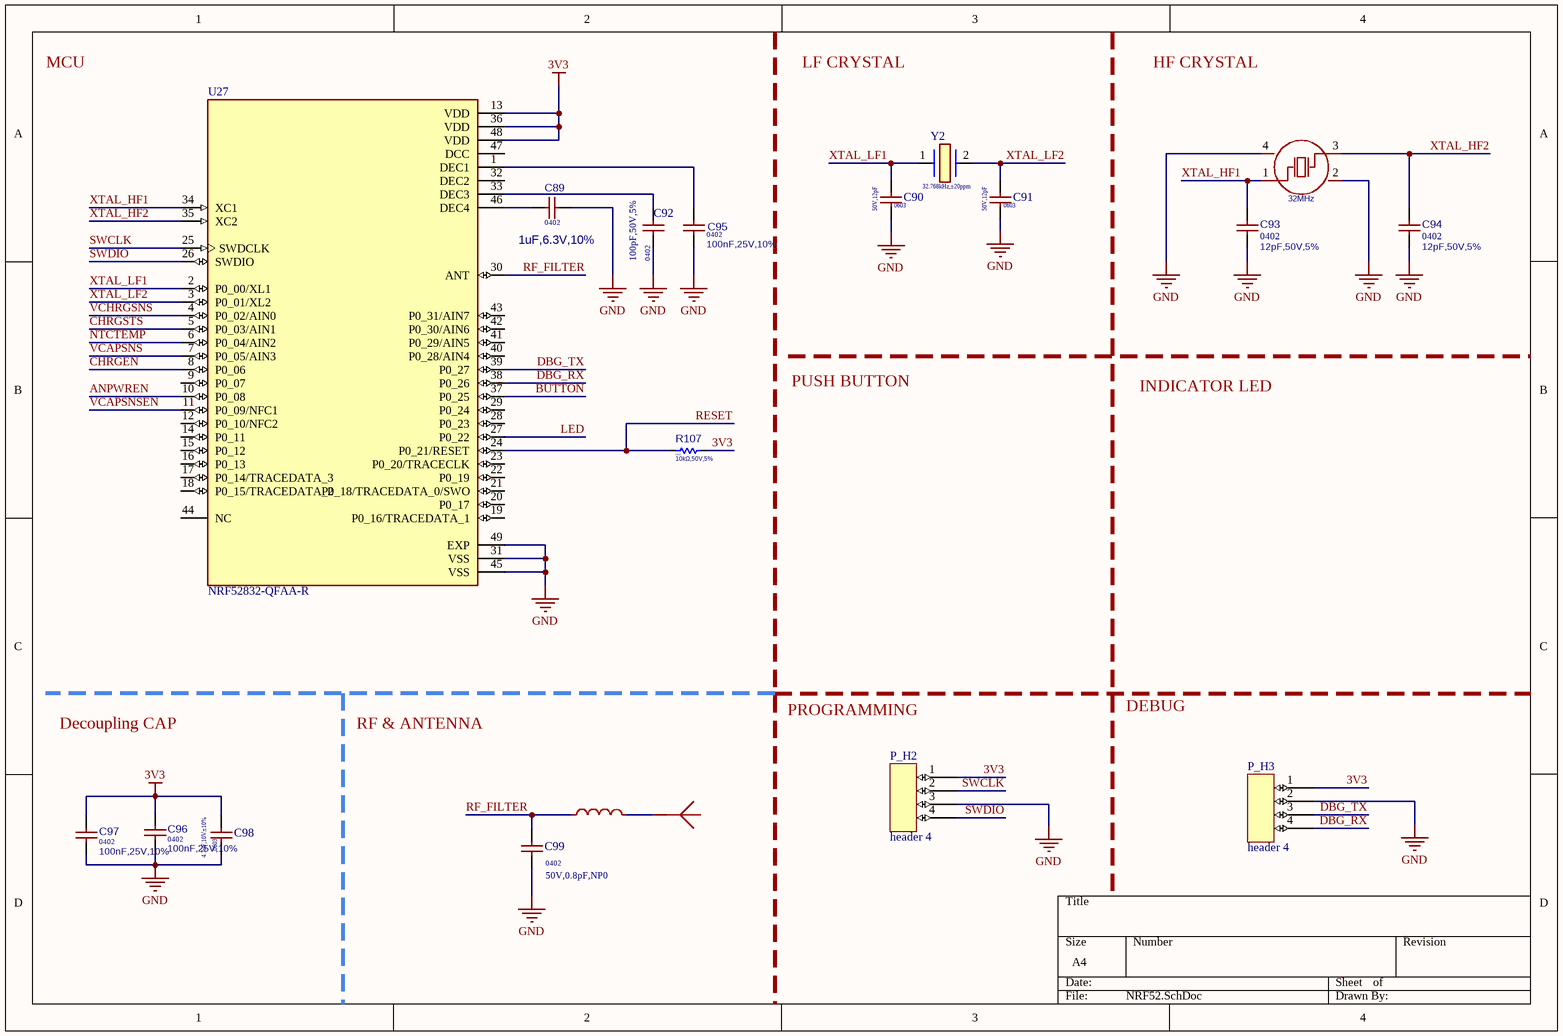
[diagram p27: NRF52.SchDoc]

### Parts
AE1  2450AT18A100E  [ANT 1206]  (value not drawn)
C89  value 1uF,6.3V,10%  Package: 0402  [C0402]  (hidden comment: 1uF)
C90  value 50V,12pF  Package: 0603  [CAPC1608X90N]  (hidden comment: 12pF)
C91  value 50V,12pF  Package: 0603  [CAPC1608X90N]  (hidden comment: 12pF)
C92  value 100pF,50V,5%  Package: 0402  [C0402]  (hidden comment: 100pF)
C93  Package: 0402  [C0402]  (hidden comment: 12pF,50V,5%)
C94  Package: 0402  [C0402]  (hidden comment: 12pF,50V,5%)
C95  value 100nF,25V,10%  Package: 0402  [C0402]  (hidden comment: 100nF)
C96  value 100nF,25V,10%  Package: 0402  [C0402]  (hidden comment: 100nF)
C97  value 100nF,25V,10%  Package: 0402  [C0402]  (hidden comment: 100nF)
C98  value 4.7uF,10V±10%  Package: 0603  [C0603]  (hidden comment: 4.7uf)
C99  value 50V,0.8pF,NP0  Package: 0402  [C0402]  (hidden comment: 0.8pF)
L4  3.9nH  [L-0402]  (value not drawn)
P_H2  header 4  [pin header 4]
P_H3  header 4  [pin header 4]
R107  value 10kΩ,50V,5%  Package: 0402  [R0402]  (hidden comment: 10kΩ)
U27  NRF52832-QFAA-R  [QFN40P600X600X90-49N]
X3  32MHz  [SMD2016-4P,crystral]
Y2  value 32.768kHz,±20ppm  [SMD3215-2P]  (hidden comment: 32.768kHz)

### Nets
3V3: C96.2 C97.2 C98.1 P_H2.1 P_H3.1 R107.2 U27.13(VDD) U27.36(VDD) U27.48(VDD)
GND: C89.2 C90.1 C91.1 C92.1 C93.1 C94.1 C95.1 C96.1 C97.1 C98.2 C99.1 P_H2.3 P_H3.2 U27.31(VSS) U27.45(VSS) U27.49(EXP) X3.2 X3.4
ANPWREN: U27.10(P0_08)
BUTTON: U27.37(P0_25)
CHRGEN: U27.8(P0_06)
CHRGSTS: U27.5(P0_03/AIN1)
DBG_RX: P_H3.4 U27.38(P0_26)
DBG_TX: P_H3.3 U27.39(P0_27)
LED: U27.27(P0_22)
NTCTEMP: U27.6(P0_04/AIN2)
RESET: R107.1 U27.24(P0_21/RESET)
RF_FILTER: C99.2 L4.1 U27.30(ANT)
SWCLK: P_H2.2 U27.25(SWDCLK)
SWDIO: P_H2.4 U27.26(SWDIO)
VCAPSNS: U27.7(P0_05/AIN3)
VCAPSNSEN: U27.11(P0_09/NFC1)
VCHRGSNS: U27.4(P0_02/AIN0)
XTAL_HF1: C93.2 U27.34(XC1) X3.1(OSC1)
XTAL_HF2: C94.2 U27.35(XC2) X3.3(OSC2)
XTAL_LF1: C90.2 U27.2(P0_00/XL1) Y2.1(CRYSTAL_2)
XTAL_LF2: C91.2 U27.3(P0_01/XL2) Y2.2
NetAE1_1: AE1.1(ANT) L4.2
NetC89_1: C89.1 U27.46(DEC4)
NetC92_2: C92.2 U27.33(DEC3)
NetC95_2: C95.2 U27.1(DEC1)

Not connected (* = marked no-connect by the designer): AE1 2; U27 9(P0_07) 12(P0_10/NFC2) 14(P0_11) 15(P0_12) 16(P0_13) 17(P0_14/TRACEDATA_3) 18(P0_15/TRACEDATA_2) 19(P0_16/TRACEDATA_1) 20(P0_17) 21(P0_18/TRACEDATA_0/SWO) 22(P0_19) 23(P0_20/TRACECLK) 28(P0_23) 29(P0_24) 32(DEC2) 40(P0_28/AIN4) 41(P0_29/AIN5) 42(P0_30/AIN6) 43(P0_31/AIN7) 44(NC) 47(DCC)

### Notes on the sheet
- MCU
- LF CRYSTAL
- HF CRYSTAL
- PUSH BUTTON
- INDICATOR LED
- PROGRAMMING
- DEBUG
- Decoupling CAP
- RF & ANTENNA

### Library data of the parts
AE1 = 2450AT18A100E: 0.5dBi 2.4G Antenna 2.4GHz 2W 1206 Antennas ROHS; Manufacturer: JOHANSON; LCSC: C89334; MPN: 2450AT18A100E; Package: 1206; Datasheet: https://atta.szlcsc.com/upload/public/pdf/source/20180301/C89334_15198946260391384223.pdf; Operating Temperature: -40℃~+125℃
C89 = CC0402KRX7R5BB105: 6.3V 1uF X7R ±10% 0402 Multilayer Ceramic Capacitors MLCC - SMD/SMT ROHS; Manufacturer: YAGEO; Type: *; Min Operating Temp: -55; Datasheet: https://www.lcsc.com/datasheet/lcsc_datasheet_2409272231_YAGEO-CC0402KRX7R5BB105_C115046.pdf; MPN: CC0402KRX7R5BB105; Max Operating Temp: +85; LCSC: C115046
C90 C91 = 0603CG120J500NT: 50V 12pF C0G ±5% 0603 Multilayer Ceramic Capacitors MLCC - SMD/SMT ROHS; Manufacturer: FH; Datasheet: https://datasheet.lcsc.com/lcsc/2304140030_FH--Guangdong-Fenghua-Advanced-Tech-0603CG120J500NT_C1642.pdf; LCSC: C1642; MPN: 0603CG120J500NT
C92 = CC0402JRNPO9BN101: 50V 100pF NP0 ±5% 0402 Multilayer Ceramic Capacitors MLCC - SMD/SMT ROHS; Manufacturer: YAGEO; Datasheet: https://www.lcsc.com/datasheet/lcsc_datasheet_2304140030_YAGEO-CC0402JRNPO9BN101_C106200.pdf; LCSC: C106200; MPN: CC0402JRNPO9BN101
C93 C94 = CL05C120JB51PNC: 12 pF ±5% 50V Ceramic Capacitor C0G, NP0 0402 (1005 Metric); Manufacturer: SAMSUNG; Min Operating Temp: -55; Datasheet: https://mm.digikey.com/Volume0/opasdata/d220001/medias/docus/41/CL05C120JB51PNC_Spec.pdf; MPN: CL05C120JB51PNC; Max Operating Temp: +125; LCSC: C472446; value: 12pF,50V,5%
C95-C97 = CL05A104KA5NNNC: 25V 100nF X5R ±10% 0402 Multilayer Ceramic Capacitors MLCC - SMD/SMT ROHS; Manufacturer: SAMSUNG; Type: *; MPN: CL05A104KA5NNNC; Max Operating Temp: +85; Min Operating Temp: -55; Datasheet: https://datasheet.lcsc.com/lcsc/2304140030_Samsung-Electro-Mechanics-CL05A104KA5NNNC_C100072.pdf; LCSC: C100072
C98 = 0603B475K100NT: 10V 4.7uF X7R ±10% 0603 Multilayer Ceramic Capacitors MLCC - SMD/SMT ROHS; MPN: CL10A475KQ8NNNC; Manufacturer: Samsung Electro-Mechanics; Datasheet: https://lcsc.componentsearchengine.com/Datasheets/2/CL10A475KQ8NNNC.pdf
C99 = RF15N0R8A500: 50V 0.8pF NP0 0402 Multilayer Ceramic Capacitors MLCC - SMD/SMT ROHS; Manufacturer: Walsin Tech Corp; LCSC: C172853; Datasheet: https://www.lcsc.com/datasheet/lcsc_datasheet_2304140030_Walsin-Tech-Corp-RF15N0R8A500_C172853.pdf; MPN: RF15N0R8A500
L4 = SDCL1005C3N9STDF: 300mA 3.9nH 200mΩ 0402 Inductors (SMD) ROHS; Manufacturer: Sunlord; LCSC: C14033; MPN: SDCL1005C3N9STDF; Package: 0402; Datasheet: https://atta.szlcsc.com/upload/public/pdf/source/20231027/6126A3AAC5912C34388756BE22DEE00C.pdf
P_H2 P_H3 = header 4: Straight 2.54mm 6mm -40℃~+105℃ 1 3mm 4 2.54mm Black Brass 1x4P Straight,P=2.54mm Pin Headers ROHS
R107 = RC0402JR-0710KL: as R31-R33 on sheet ETHERNET_STM32; MPN: RC0402JR-0710KL; Max Operating Temp: +155; Min Operating Temp: -55; Datasheet: https://datasheet.lcsc.com/lcsc/1810241334_YAGEO-RC0402JR-0710KL_C60489.pdf; LCSC: C60489
U27 = NRF52832-QFAA-R: IC RF TxRx + MCU Bluetooth, General ISM > 1GHz ANT, Bluetooth v5.0 2.4GHz 48-VFQFN Exposed Pad; Manufacturer: Nordic; LCSC: C77540; Package: VFQFN-48 Nordic Semiconductor; Value: *; MPN: NRF52832-QFAA-R; Datasheet: https://www.lcsc.com/datasheet/lcsc_datasheet_1810010217_Nordic-Semicon-NRF52832-QFAA-R_C77540.pdf; Operating Temperature: -40°C ~ 85°C
X3 = X2C032000B81H-HS: 32MHz,SMD2016-4P Crystals ROHS; Manufacturer: HELE; LCSC: C254298; MPN: X2C032000B81H-HS; Package: SMD2016-4P; Datasheet: https://atta.szlcsc.com/upload/public/pdf/source/20190430/C254298_7A65B7D2FB33A890B7E374D25EF99C0B.pdf
Y2 = Q13FC1350000400: 32.768kHz SMD Crystal Resonator 12.5pF 70kΩ ±20ppm -40℃~+85℃ SMD3215-2P Crystals ROHS; Manufacturer: Seiko Epson; MPN: Q13FC1350000400; Datasheet: https://datasheet.lcsc.com/lcsc/1810171817_Seiko-Epson-Q13FC13500004_C32346.pdf; Package: SMD3215-2P; LCSC: C32346